# Altium project keyboard.PrjPcb
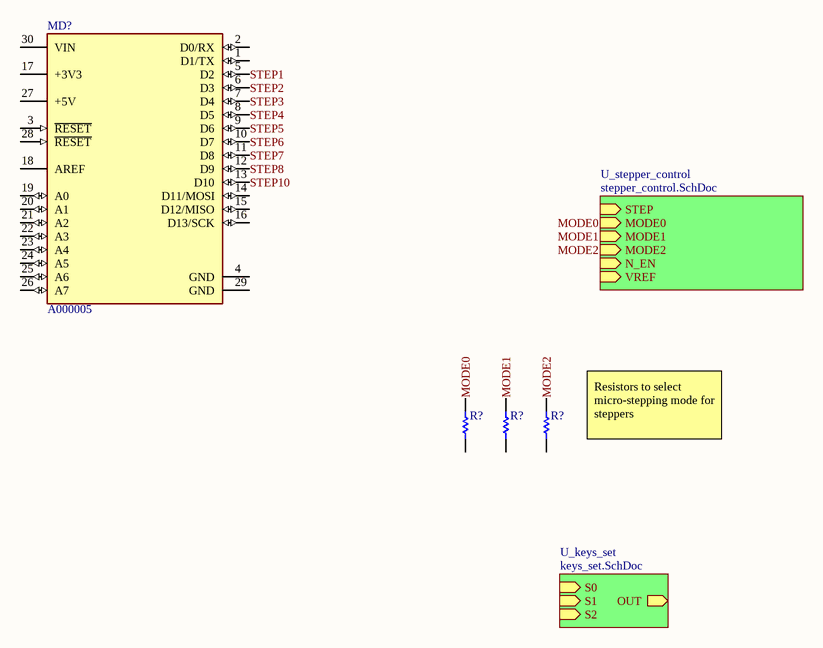
[diagram p0: top.SchDoc]
3 sheets, 22 parts. Net scope: hierarchical (ports join the sheet entries above them; power ports are global).
Sheets:
  top.SchDoc
    U_stepper_control = stepper_control.SchDoc
    U_keys_set = keys_set.SchDoc

## Sheet top.SchDoc
size A; SheetNumber: 1; SheetTotal: 3

### Parts
(Parts that share a designator on the sheet are numbered #1, #2 ... from top to bottom, then left to right.)
MD?  A000005  [FP-A000005-MFG]
R?#1  RC0603JR-070RL  [RESC1608X55X25ML10T15]  (value not drawn)
R?#2  RC0603JR-070RL  [RESC1608X55X25ML10T15]  (value not drawn)
R?#3  RC0603JR-070RL  [RESC1608X55X25ML10T15]  (value not drawn)

### Sub-sheets
U_keys_set = keys_set.SchDoc: S0 (in), S1 (in), S2 (in), OUT (out)
U_stepper_control = stepper_control.SchDoc: STEP (in), MODE0 (in), MODE1 (in), MODE2 (in), N_EN (in), VREF (in)

### Nets
MODE0: R?#1.1 ; sheet U_stepper_control/MODE0
MODE1: R?#2.1 ; sheet U_stepper_control/MODE1
MODE2: R?#3.1 ; sheet U_stepper_control/MODE2
STEP1: MD?.5(D2)
STEP2: MD?.6(D3)
STEP3: MD?.7(D4)
STEP4: MD?.8(D5)
STEP5: MD?.9(D6)
STEP6: MD?.10(D7)
STEP7: MD?.11(D8)
STEP8: MD?.12(D9)
STEP10: MD?.13(D10)

Not connected (* = marked no-connect by the designer): MD? 1(D1/TX) 2(D0/RX) 3(~{RESET}) 4(GND) 14(D11/MOSI) 15(D12/MISO) 16(D13/SCK) 17(+3V3) 18(AREF) 19(A0) 20(A1) 21(A2) 22(A3) 23(A4) 24(A5) 25(A6) 26(A7) 27(+5V) 28(~{RESET}) 29(GND) 30(VIN); R?#1 2; R?#2 2; R?#3 2

### Notes on the sheet
- (near R?#3) Resistors to select micro-stepping mode for steppers

### Library data of the parts
MD? = CMP-189986-000002-1: ARDUINO NANO ATMEGA328 EVAL BRD; Number of Bits: 8; Evaluation Kit: Yes; Operating Supply Voltage: 12V; Interface: I2C; Data Bus Width: 8b; Core Architecture: AVR; Packaging: Bulk; Length: 7inch; Package Quantity: 50; Width: 5inch; REACH SVHC: No SVHC; Weight: 0.358383oz; Series: AVR® ATmega; Height: 0.25inch
R?#1-R?#3 = CMP-2100-03667-1: Chip Resistor, 0 Ohm, +/- 5%, 0.1 W, -55 to 155 degC, 0603 (1608 Metric), RoHS, Tape and Reel; Manufacturer: Yageo; Temperature Coefficient: 200ppm/degreesC; Voltage Rating: 50V; Power Rating: 100mW; Resistance: 0mOhm; Width: 0.8mm; Max Operating Temperature: 155degC; Tolerance: 5%; Package Reference: 0603; Height: 0.45mm; Depth: 0.8mm; Package Description: 2-Pin Surface Mount Device, Body 1.6 x 0.8 mm; Termination: SMD/SMT; Package Quantity: 5000; Case/Package: 0603; Case Code (Imperial): 0603; Radiation Hardening: No; Number of Pins: 2; Length: 1.6mm; Lead Free: LeadFree; Voltage Rating (DC): 50V; Military Standard: Not; Datasheet URL: http://www.yageo.com/NewPortal/yageodocoutput?fileName=/pdf/R-Chip/PYu-RC_Group_51_RoHS_L_5.pdf; Manufacturer URL: http://www.yageo.com/; Packaging: TapeandReel; Case Code (Metric): 1608; Min Operating Temperature: -55degC; Composition: ThickFilm; RoHSCompliant: true; Contact Plating: Tin; Datasheet Version: Rev. 5, 10/2016; REACH SVHC: NoSVHC

## Sheet stepper_control.SchDoc
size A; SheetNumber: 2; SheetTotal: 3
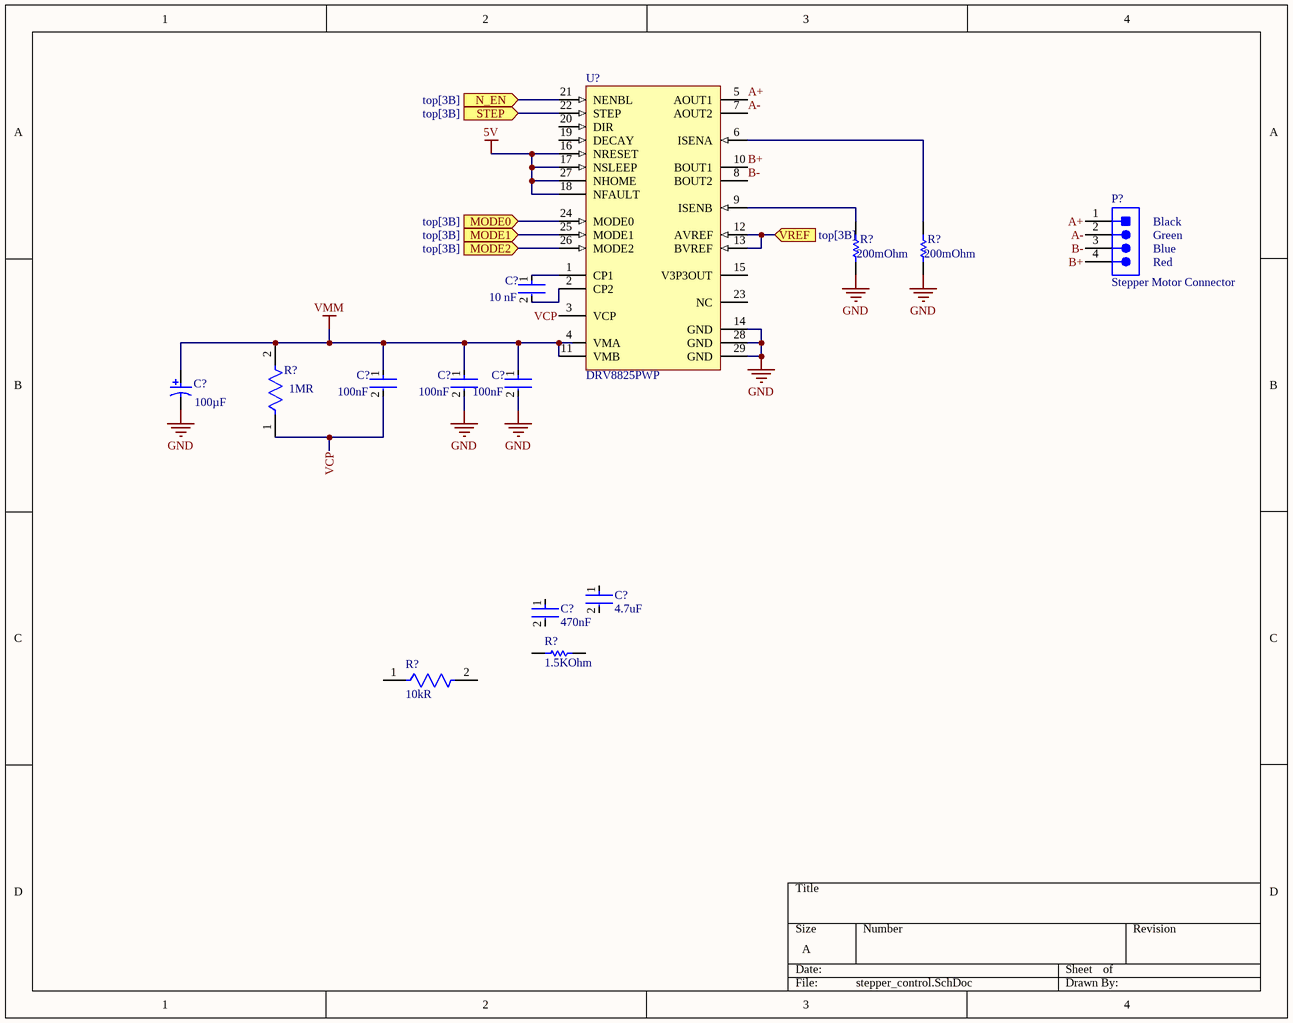
[diagram p1: stepper_control.SchDoc]

### Parts
(Parts that share a designator on the sheet are numbered #1, #2 ... from top to bottom, then left to right.)
C?#1  value 10 nF  [FP-CC0603-DA-MFG]  (hidden comment: CC0603KRX7R9BB103)
C?#2  Capacitance: 100µF  [PNSC-FK-V-D8_V]  (hidden comment: EEEFK1E101XP)
C?#3  value 100nF  [FP-C0603-CJ-MFG]  (hidden comment: C0603X104K5RACTU)
C?#4  value 100nF  [FP-C0603-CJ-MFG]  (hidden comment: C0603X104K5RACTU)
C?#5  value 100nF  [FP-C0603-CJ-MFG]  (hidden comment: C0603X104K5RACTU)
C?#6  Capacitance: 4.7uF  [FP-GRM188-0_2-IPC_C]  (hidden comment: GRM188R6YA475KE15D)
C?#7  Capacitance: 470nF  [FP-GRM188-0_1-e0_2_0_5-MFG]  (hidden comment: GRM188R71E474KA12D)
P?  Stepper Motor Connector  [JST-B4B-PH-K-S_V]
R?#4  Resistance: 200mOhm  [RESC1609X60X30LL10T20]  (hidden comment: RCWE0603R200FKEA)
R?#5  Resistance: 200mOhm  [RESC1609X60X30LL10T20]  (hidden comment: RCWE0603R200FKEA)
R?#6  Resistance: 1MR  [FP-CRCW0603-HPe3-IPC_B]  (hidden comment: CRCW06031M00FKEAHP)
R?#7  Resistance: 1.5KOhm  [RESC1608X55X25ML10T15]  (hidden comment: RC0603FR-071K5L)
R?#8  Resistance: 10kR  [FP-RC0603-0_55-IPC_C]  (hidden comment: RC0603FR-0710KL)
U?#1  DRV8825PWP  [PWP0028C_L]

### Ports
MODE0 (in, see top[3B]), MODE1 (in, see top[3B]), MODE2 (in, see top[3B]), N_EN (in, see top[3B]), STEP (in, see top[3B]), VREF (in, see top[3B])

### Nets
5V: U?#1.16(NRESET) U?#1.17(NSLEEP) U?#1.18(NFAULT) U?#1.27(NHOME)
GND: C?#2.2 C?#4.2 C?#5.2 R?#4.2 R?#5.2 U?#1.14(GND) U?#1.28(GND) U?#1.29(GND)
VMM: C?#2.1 C?#3.1 C?#4.1 C?#5.1 R?#6.2 U?#1.4(VMA) U?#1.11(VMB)
A+: P?.1 U?#1.5(AOUT1)
A-: P?.2 U?#1.7(AOUT2)
B+: P?.4 U?#1.10(BOUT1)
B-: P?.3 U?#1.8(BOUT2)
MODE0: U?#1.24(MODE0) ; port MODE0
MODE1: U?#1.25(MODE1) ; port MODE1
MODE2: U?#1.26(MODE2) ; port MODE2
VCP: C?#3.2 R?#6.1 U?#1.3(VCP)
NetC?#1_1: C?#1.1 U?#1.1(CP1)
NetC?#1_2: C?#1.2 U?#1.2(CP2)
NetR?#4_1: R?#4.1 U?#1.9(ISENB)
NetR?#5_1: R?#5.1 U?#1.6(ISENA)
NetU?#1_12: U?#1.12(AVREF) U?#1.13(BVREF) ; port VREF
NetU?#1_21: U?#1.21(NENBL) ; port N_EN
NetU?#1_22: U?#1.22(STEP) ; port STEP

Not connected (* = marked no-connect by the designer): C?#6 1 2; C?#7 1 2; R?#7 1 2; R?#8 1 2; U?#1 15(V3P3OUT) 19(DECAY) 20(DIR) 23(NC)

### Notes on the sheet
- (near P?) Black
- (near P?) Green
- (near P?) Blue
- (near P?) Red

### Library data of the parts
C?#1 = CMP-2100-03600-2: CAP CER 10000PF 50V X7R 0603; Manufacturer: YAGEO; Tolerance: 0.1; Material: Ceramic; Temperature Coefficient: 15%; Description: CC0603 10 nF X7R 10.00% 50 V; Mouser Description: Multilayer Ceramic Capacitor, CC Series, 0.01 - F, - 10%, X7R, 50 V, 0603 [1608 Metric]; Digikey Description: CAP CER 10000PF 50V X7R 0603; Height: 0.9mm; Category: Cap; Temperature Characteristic: X7R; Footprint Url: http://www.yageo.com/exep/pages/download/literatures/UPY-C_GEN_24.pdf; Lead Free: Yes; Voltage Rating: 50 V; Manufacturer Part Number: CC0603KRX7R9BB103; Temperature: -55°C to +125°C; Device Class L3: Ceramic Capacitors; ComponentLink2Description: Datasheet; Voltage: 50 V; Package: CC0603-DA; Octopart: https://octopart.com/cc0603krx7r9bb103-yageo-192938; Automotive: No; Temperature Range High: +125°C; Temperature Range Low: -55°C; RoHS: TRUE; Device Class L1: Passive Components; ComponentLink2URL: http://www.yageo.com/documents/recent/UPY-GPHC_X7R_6.3V-to-50V_18.pdf; Device Class L2: Capacitors; Capacitance: 10 nF
C?#2 = CMP-2000-06206-1: Aluminum Electrolytic Capacitor, 100 uF, +/- 20%, 25 V, 2-Pin SMD (Size Code D8), -55 to 105 degC, RoHS, Tape and Reel; Manufacturer: Panasonic; Type: Can; Lifetime@Temperature: 2000Hrs@105°C; Rated Voltage: 25V; Ripple Current: 280mA; Impedance: 0.34O; Case Size/Dimension: Ø6.3x7.7mm; Operating Temp-Max: 105°C; Series: FK; Package URL: http://industrial.panasonic.com/cdbs/www-data/pdf/RDE0000/DME0000COL48.pdf; Mounting Technology: SurfaceMount; Package Description: 2-Pin Electrolytic Aluminum Capacitor, Body 6.6 x 6.6 mm; Datasheet Version: 03/2016; Datasheet URL: http://industrial.panasonic.com/cdbs/www-data/pdf/RDE0000/ABA0000C1181.pdf; Manufacturer URL: http://www.panasonic.com/; Package Reference: FK-V-D8; Operating Temp Range: -55to+105°C
C?#3-C?#5 = CMP-2006-03300-2: CAP CER 0.1UF 50V X7R 0603; Manufacturer: Kemet; Description: Ceramic Chip Capacitor 0.1µF ±10% 50V; Material: Ceramic; Tolerance: 10%; Temperature Coefficient: 15%; Temperature Range High: +125°C; Temperature Range Low: -55°C; Manufacturer Part Number: C0603X104K5RACTU; Voltage: 50V; ComponentLink2Description: Datasheet; RoHS: TRUE; ComponentLink2URL: https://content.kemet.com/datasheets/KEM_C1013_X7R_FT-CAP_SMD.pdf; Capacitance: 100nF; Device Class L3: Ceramic Capacitors; Device Class L2: Capacitors; Package: C0603-CJ; Height: 0.95mm; Device Class L1: Passive Components; Temperature Characteristic: X7R; Lead Free: Yes; Digikey Description: CAP CER 0.1UF 50V X7R 0603; Automotive: No; Mouser Description: Capacitor; Ceramic; Cap 0.1uF; Tol+10%; SMT; Flexible Termination; Vol-Rtg 50V; TR; Temperature: -55°C to +125°C; Octopart: https://octopart.com/c0603x104k5ractu-kemet-9145062; Category: Cap; Voltage Rating: 50V; Ipc Land Pattern Name: CAPC16080X80
C?#6 = CMP-2006-02545-2: Chip Multilayer Ceramic Capacitors for General Purpose, 0603, 4.7uF, X5R, 15%, 10%, 35V; Lead Free: Lead Free; Max Operating Temperature: 85°C; Case Code (Imperial): 0603; Width: 0.8mm; Thickness: 0.031inch; Case Code (Metric): 1608; Min Operating Temperature: -55°C; Voltage Rating (DC): 35V; Dielectric: X5R; Voltage: 35V; Packaging: Tape and Reel; Resistor Type: Ceramic; Weight: 0.000222oz; Mount: Surface Mount; Material: Ceramic; Depth: 0.8mm; Tolerance: 10%; REACH SVHC: No SVHC; Case/Package: 0603; Voltage Rating: 35V; Package Quantity: 4000; Height: 0.8mm; Length: 1.6mm; Termination: SMD/SMT
C?#7 = CMP-06035-003857-1: Chip Multilayer Ceramic Capacitors for General Purpose, 0603, 0.47uF, X7R, 15%, 10%, 25V; Voltage: 50V; Case Code (Imperial): 0603; Mount: Surface Mount; Material: Ceramic; Case/Package: 0603; Thickness: 0.035inch; Tolerance: 10%; Length: 1.6mm; Lead Free: Lead Free; Voltage Rating: 25V; Width: 0.031inch; Voltage Rating (DC): 25V; Dielectric: X7R; Case Code (Metric): 1608; Number of Pins: 2; Termination: SMD/SMT; REACH SVHC: No SVHC; Min Operating Temperature: -55°C; Max Operating Temperature: 125°C; Depth: 0.8mm; Height: 0.8mm; Package Quantity: 4000; Packaging: Tape and Reel
P? = CMP-2000-05165-1: Male Header, Pitch 2 mm, 1 x 4 Position, Height 6 mm, Tail Length 3.4 mm, -25 to 85 degC, RoHS, Bulk; Manufacturer: JST; No of Positions: 4; Style/Orientation: StraightHeader/Plug; Pitch: 2mm; Datasheet URL: http://datasheet.octopart.com/B4B-PH-K-S%28LF%29%28SN%29-JST-datasheet-10558886.pdf; Type: ShroudedHeader; Manufacturer URL: http://www.jst.com/home2.html; Termination: Crimp; Datasheet Version: Apr-09
R?#4 R?#5 = CMP-2000-03665-1: Manufacturer: Vishay Dale; Part Number: RCWE0603R200FKEA
R?#6 = CMP-02407-005501-1: RES Thick Film, 1MΩ, 1%, 0.33W, 100ppm/°C, 0603; Max Power Dissipation: 250mW; Voltage Rating: 75V; Case Code (Imperial): 0603; Tolerance: 1%; Number of Terminations: 2; Width: 0.033inch; Composition: Thick Film; Contact Plating: Tin; Temperature Coefficient: 100ppm/°C; Package Quantity: 10; Length: 1.6mm; Min Operating Temperature: -55°C; Height: 0.45mm; Case Code (Metric): 1608; Lead Free: Lead Free; Termination: SMD/SMT; Packaging: Tape and Reel; Features: Automotive AEC-Q200; Max Operating Temperature: 155°C; Radiation Hardening: No; Case/Package: 0603; Depth: 0.85mm; Power Rating: 250mW; Weight: 7.1E-05oz
R?#7 = CMP-2100-03665-1: Chip Resistor, 1.5 KOhm, +/- 1%, 0.1 W, -55 to 155 degC, 0603 (1608 Metric), RoHS, Tape and Reel; Manufacturer: Yageo; Power Rating: 100mW; Voltage Rating: 50V; Temperature Coefficient: 100ppm/degreesC; Military Standard: Not; Datasheet URL: http://www.yageo.com/NewPortal/yageodocoutput?fileName=/pdf/R-Chip/PYu-RC_Group_51_RoHS_L_5.pdf; Package Description: 2-Pin Surface Mount Device, Body 1.6 x 0.8 mm; Composition: ThickFilm; Case Code (Metric): 1608; Case/Package: 0603; Number of Terminations: 2; Depth: 0.8mm; Height: 0.022inch; Manufacturer URL: http://www.yageo.com/; Lead Free: LeadFree; Min Operating Temperature: -55degC; Max Operating Temperature: 155degC; Datasheet Version: Rev. 5, 10/2016; RoHSCompliant: true; Max Power Dissipation: 100mW; Packaging: TapeandReel; Voltage Rating (DC): 50V; Length: 0.063inch; Tolerance: 1%; Width: 0.031inch; Number of Pins: 2; Termination: SMD/SMT; Package Reference: 0603; Package Quantity: 1; Case Code (Imperial): 0603; REACH SVHC: NoSVHC
R?#8 = CMP-2100-03664-2: RES 10K OHM 1% 1/10W 0603; Voltage Rating: 75V; Voltage Rating (DC): 50V; Power Rating: 100mW; Temperature Coefficient: 100ppm/°C; Depth: 0.8mm; Termination: SMD/SMT; Resistor Type: Thick Film; Series: RC; Construction: Rectangular; Features: Moisture Resistant; Packaging: Tape and Reel; Min Operating Temperature: -55°C; Number of Terminations: 2; Lead Pitch: 0.3mm; RoHS Compliant: Yes; Case/Package: 0603; Resistance Tolerance: 1%; Military Standard: Not; Weight: 7.1E-05oz; Number of Pins: 2; Tolerance: 1%; Length: 1.6mm; Case Code (Imperial): 0603; Lead Free: Lead Free; Width: 0.8mm; Max Power Dissipation: 100mW; Height: 0.45mm; Max Operating Temperature: 155°C; Case Code (Metric): 1608; Size Code: 0603
U?#1 = CMP-1685-00019-1: Stepper Motor Controller IC, 8.2 to 45 V, -40 to 85 degC, 28-Pin HTSSOP (PWP), Green (RoHS & no Sb/Br), Tube; Voltage Rating: 100 V; Tolerance: 20%; Capacitance: 47 uF; Case\Package: Radial; ComponentLink2URL: http://www.ti.com/general/docs/lit/getliterature.tsp?genericPartNumber=DRV8825&fileType=pdf; Voltage Rating (DC): 100 V; Lead Pitch: 3.5 mm; Diameter: 8 mm; DatasheetVersion: SLVSA73F, 07/2014; ComponentLink2Description: Datasheet; Package Quantity: 200; PackageDescription: 28-Pin Small Outline Package Integrated Circuit, Body 9.7 x 4.4 mm, Pitch 0.65 mm; Packaging: Bulk; Pins: 2; Min Operating Temperature: -40 degC; Width: 8 mm; ComponentLink1Description: Manufacturer URL; Length: 11.5 mm; Max Operating Temperature: 85 degC; Height: 11.5 mm; REACH SVHC: No SVHC; Mount: Through Hole; PackageReference: PWP0028C; RoHSCompliant: true; Radiation Hardening: No; ComponentLink1URL: http://www.ti.com/

## Sheet keys_set.SchDoc
size A; SheetNumber: 3; SheetTotal: 3
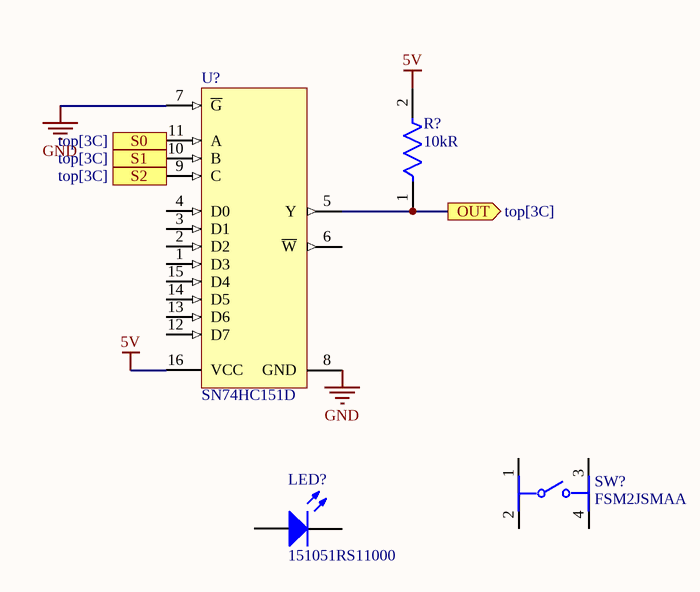
[diagram p2: keys_set.SchDoc]

### Parts
(Parts that share a designator on the sheet are numbered #1, #2 ... from top to bottom, then left to right.)
LED?  151051RS11000  [Type 5mm]
R?#9  Resistance: 10kR  [FP-RC0603-0_55-IPC_C]  (hidden comment: RC0603FR-0710KL)
SW?  FSM2JSMAA  [FP-FSM2JSMAA-MFG]
U?#2  SN74HC151D  [D0016A_L]

### Ports
OUT (out, see top[3C]), S0 (in, see top[3C]), S1 (in, see top[3C]), S2 (in, see top[3C])

### Nets
5V: R?#9.2 U?#2.16(VCC)
GND: U?#2.7(~{G}) U?#2.8(GND)
NetR?#9_1: R?#9.1 U?#2.5(Y) ; port OUT
NetU?#2_9: U?#2.9(C) ; port S2
NetU?#2_10: U?#2.10(B) ; port S1
NetU?#2_11: U?#2.11(A) ; port S0

Not connected (* = marked no-connect by the designer): LED? 1(K) 2(A); SW? 1 2 3 4; U?#2 1(D3) 2(D2) 3(D1) 4(D0) 6(~{W}) 12(D7) 13(D6) 14(D5) 15(D4)

### Library data of the parts
LED? = CMP-1488-00008-1: THT LED round mono-color color lens, WL-TMRW, Red; Manufacturer: Wuerth Elektronik; PackageReference: Type 5mm; PartNumber: 151051RS11000; ComponentLink2URL: http://katalog.we-online.de/pbs/datasheet/7448042001.pdfhttp://katalog.we-online.de/pbs/datasheet/7448042001.pdfhttp://katalog.we-online.de/pbs/datasheet/7448042001.pdfhttp://katalog.we-online.de/pbs/datasheet/151051RS11000.pdf; ComponentLink1URL: http://www.we-online.com; ComponentLink1Description: Manufacturer URL; ComponentLink2Description: Datasheet; Emitting color: Red
R?#9 = CMP-2100-03664-2: as R?#8 on sheet stepper_control; Depth: 0.8mm; Termination: SMD/SMT; Resistor Type: Thick Film; Series: RC; Construction: Rectangular; Features: Moisture Resistant; Packaging: Tape and Reel; Min Operating Temperature: -55°C; Number of Terminations: 2; Lead Pitch: 0.3mm; RoHS Compliant: Yes; Case/Package: 0603; Resistance Tolerance: 1%; Military Standard: Not; Weight: 7.1E-05oz; Number of Pins: 2; Tolerance: 1%; Length: 1.6mm; Case Code (Imperial): 0603; Lead Free: Lead Free; Width: 0.8mm; Max Power Dissipation: 100mW; Height: 0.45mm; Max Operating Temperature: 155°C; Case Code (Metric): 1608; Size Code: 0603
SW? = CMP-03402-000003-1: SWITCH TACTILE SPST-NO 0.05A 24V; Manufacturer: TE Connectivity; Standoff Height: 0.05mm; Contact Current Rating: 50mA; Electromechanical Life: 100000Cycles; Operating Force: 260gf; Contact Resistance: 100mΩ; Package: 0; Temperature Range High: +85°C; Temperature: -35°C to +85°C; Category: Switch; Manufacturer Part Number: FSM2JSMAA; RoHS: TRUE; Mouser Description: Tactile Switches TACTILE 260G FORCE S; Device Class L1: Electromechanical; Mount: Surface Mount; Height: 4.59mm; ComponentLink2URL: https://www.te.com/commerce/DocumentDelivery/DDEController?Action=showdoc&DocId=Customer+Drawing%7F2-1437565-7%7FV%7Fpdf%7FEnglish%7FENG_CD_2-1437565-7_V.pdf%7F2-1437565-8; Temperature Range Low: -35°C; Voltage Rating Dc: 24V; Lead Free: Yes; Automotive: No; Throw Configuration: SPST-NO; Octopart: https://octopart.com/fsm2jsmaa-te+connectivity-41720620; Device Class L2: Switches; Device Class L3: Pushbutton Switches; ComponentLink2Description: Datasheet; Digikey Description: SWITCH TACTILE SPST-NO 0.05A 24V
U?#2 = CMP-1633-00051-2: 8-Line To 1-Line Data Selectors/Multiplexers, D0016A, TUBE; Manufacturer: Texas Instruments; tpd @ Nom Voltage(Max)(ns): 63; Input Type: LVTTL/CMOS; Output Drive (IOL/IOH)(Max)(mA): 7.8/-7.8; ICC @ Nom Voltage(Max)(mA): 0.08; Function: Encoder/Multiplexer; Bits(#): 8; VCC(Min)(V): 2; Schmitt Trigger: No; Channels(#): 1; Voltage(Nom)(V): 3.3,5; Configuration: 8：1; Output Type: CMOS; Technology Family: HC; F @ Nom Voltage(Max)(Mhz): 28; VCC(Max)(V): 6; Rating: Catalog; Generic Part Number: SN74HC151; Code_JEDEC: MS-012 variation AC; Operating Temperature Range(C): -40 to 85; Type: Standard; DatasheetVersion: SCLS110E; PackageReference: D0016A

## Nets that join several sheets
5V: stepper_control (U?#1.16 U?#1.17 U?#1.18 U?#1.27), keys_set (R?#9.2 U?#2.16)
GND: stepper_control (8 pins), keys_set (U?#2.7 U?#2.8)
MODE0: top (R?#1.1), stepper_control (U?#1.24)
MODE1: top (R?#2.1), stepper_control (U?#1.25)
MODE2: top (R?#3.1), stepper_control (U?#1.26)